# Altium schematic sheet navigatie_switches.SchDoc
size A4; SheetNumber: 12; SheetTotal: 13
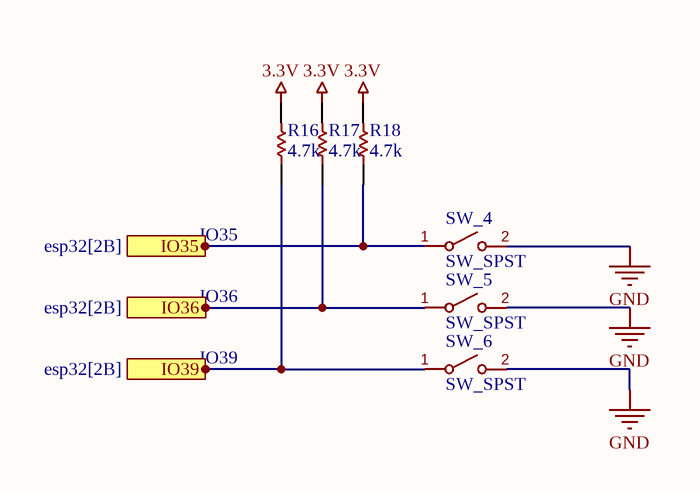
[diagram p0: navigatie_switches.SchDoc]

## Parts
R16  4.7k  [RESC2013X70X40NL20T20]
R17  4.7k  [RESC2013X70X40NL20T20]
R18  4.7k  [RESC2013X70X40NL20T20]
SW_4  SW_SPST  [SW_TS09-63-25-WT-160-SMT-TR]
SW_5  SW_SPST  [SW_TS09-63-25-WT-160-SMT-TR]
SW_6  SW_SPST  [SW_TS09-63-25-WT-160-SMT-TR]

## Ports
IO35 (see esp32[2B]), IO36 (see esp32[2B]), IO39 (see esp32[2B])

## Nets
3.3V: R16.2 R17.2 R18.2
GND: SW_4.2(B) SW_5.2(B) SW_6.2(B)
IO35: R18.1 SW_4.1(A) ; port IO35
IO36: R17.1 SW_5.1(A) ; port IO36
IO39: R16.1 SW_6.1(A) ; port IO39

## Notes on the sheet
- IO35
- IO36
- IO39

## Library data of the parts
R16-R18 = CMP-2100-03671-1: Chip Resistor, 1 KOhm, +/- 1%, 125 mW, -55 to 155 degC, 0805 (2012 Metric), RoHS, Tape and Reel; Manufacturer: Yageo; Temperature Coefficient: 100ppm/degreesC; Voltage Rating (DC): 150V; Max Power Dissipation: 125mW; Resistance: 1KOhm; Number of Pins: 2; Number of Terminations: 2; Datasheet URL: http://www.yageo.com/NewPortal/yageodocoutput?fileName=/pdf/R-Chip/PYu-RC_Group_51_RoHS_L_5.pdf; Length: 0.079inch; Package Description: 2-Pin Surface Mounted Device, Body 2 x 1.25 mm; Depth: 1.25mm; Height: 0.024inch; Military Standard: Not; Case/Package: 0805; Package Reference: 0805; RoHSCompliant: true; Lead Free: LeadFree; Packaging: TapeandReel; Package Quantity: 1; Datasheet Version: Rev. 5, 10/2016; Tolerance: 1%; Min Operating Temperature: -55degC; Voltage Rating: 150V; Composition: ThickFilm; Case Code (Imperial): 0805; Power Rating: 125mW; Width: 0.049inch; Case Code (Metric): 2012; Manufacturer URL: http://www.yageo.com/; Max Operating Temperature: 155degC; REACH SVHC: Unknown; Termination: SMD/SMT